# EAGLE design integrated_bldc (EAGLE 6.6.0)
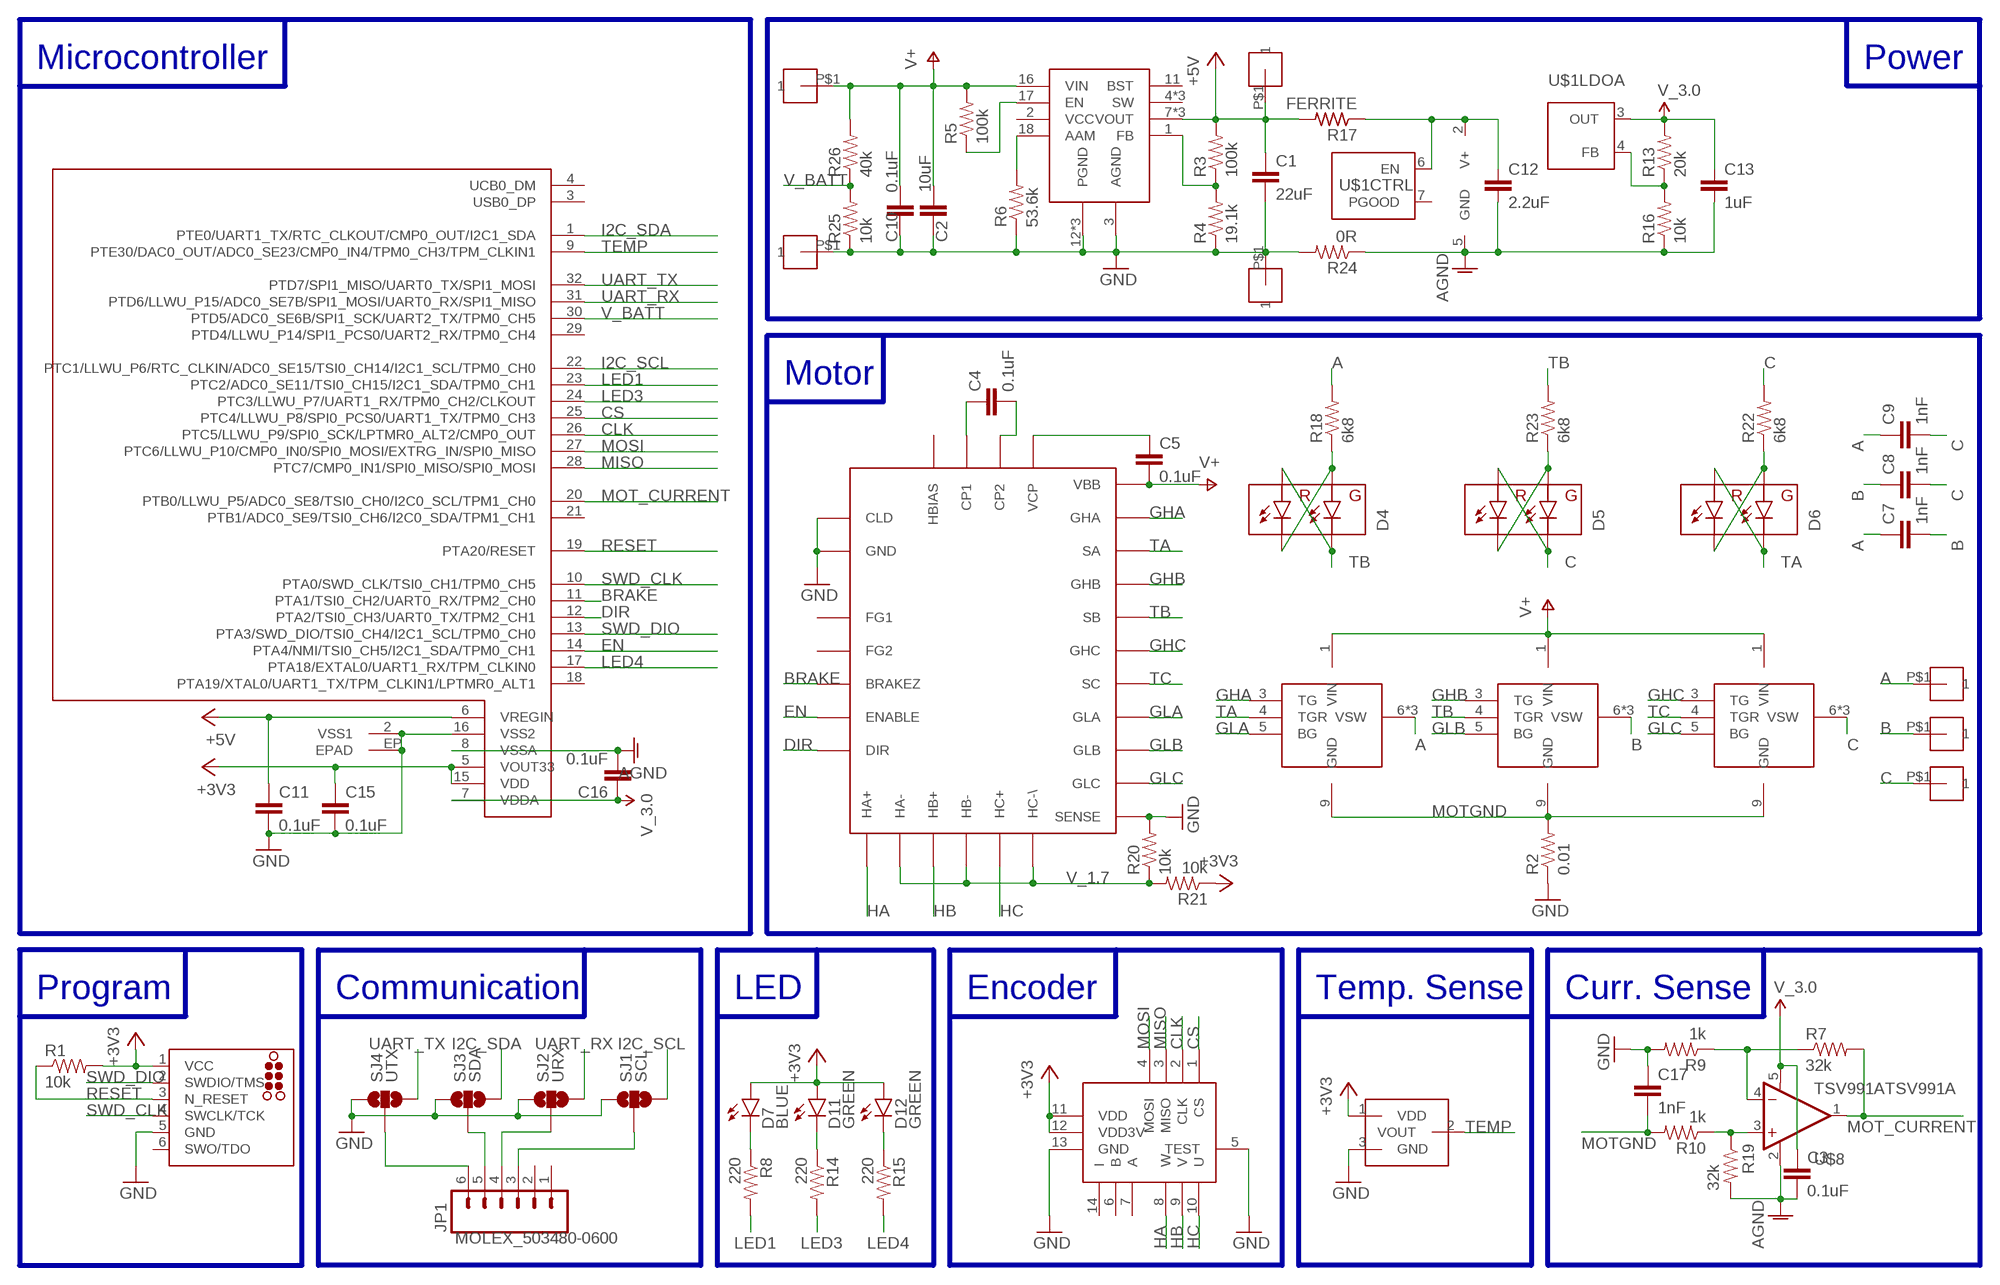
[diagram p0: schematic, sheet 1]

## Parts
AS5047P  AS5047P  [TSSOP14]
C1  22uF  CAP1210  [1210]
C2  10uF  CAP1206  [1206]
C3  0.1uF  CAP0402-CAP  [0402-CAP]
C4  0.1uF  CAP0402-CAP  [0402-CAP]
C5  0.1uF  CAP0402-CAP  [0402-CAP]
C7  1nF  CAP0603-CAP  [0603-CAP]
C8  1nF  CAP0603-CAP  [0603-CAP]
C9  1nF  CAP0603-CAP  [0603-CAP]
C10  0.1uF  CAP0603-CAP  [0603-CAP]
C11  0.1uF  CAP0402-CAP  [0402-CAP]
C12  2.2uF  CAP0402-CAP  [0402-CAP]
C13  1uF  CAP0402-CAP  [0402-CAP]
C15  0.1uF  CAP0402-CAP  [0402-CAP]
C16  0.1uF  CAP0402-CAP  [0402-CAP]
C17  1nF  CAP0402-CAP  [0402-CAP]
D4  LED-RGLTST-C195KGJRKT  [LTST-C195KGJRKT]
D5  LED-RGLTST-C195KGJRKT  [LTST-C195KGJRKT]
D6  LED-RGLTST-C195KGJRKT  [LTST-C195KGJRKT]
D7  BLUE  LED-BLUE0603  [LED-0603]
D11  GREEN  LED-GREEN0603  [LED-0603]
D12  GREEN  LED-GREEN0603  [LED-0603]
J2  PRG  TC2030-MCP-NL  [TC2030-MCP-NL]
JP1  MOLEX_503480-0600  [MOLEX_503480-0600]
R1  10k  RESISTOR0402-RES  [0402-RES]
R2  0.01  RESISTOR1206  [1206]
R3  100k  RESISTOR0402-RES  [0402-RES]
R4  19.1k  RESISTOR0402-RES  [0402-RES]
R5  100k  RESISTOR0402-RES  [0402-RES]
R6  53.6k  RESISTOR0402-RES  [0402-RES]
R7  32k  RESISTOR0402-RES  [0402-RES]
R8  220  RESISTOR0402-RES  [0402-RES]
R9  1k  RESISTOR0402-RES  [0402-RES]
R10  1k  RESISTOR0402-RES  [0402-RES]
R13  20k  RESISTOR0402-RES  [0402-RES]
R14  220  RESISTOR0402-RES  [0402-RES]
R15  220  RESISTOR0402-RES  [0402-RES]
R16  10k  RESISTOR0402-RES  [0402-RES]
R17  FERRITE  R-US_R0603  [R0603]
R18  6k8  RESISTOR0402-RES  [0402-RES]
R19  32k  RESISTOR0402-RES  [0402-RES]
R20  10k  RESISTOR0402-RES  [0402-RES]
R21  10k  RESISTOR0402-RES  [0402-RES]
R22  6k8  RESISTOR0402-RES  [0402-RES]
R23  6k8  RESISTOR0402-RES  [0402-RES]
R24  0R  RESISTOR0402-RES  [0402-RES]
R25  10k  RESISTOR0402-RES  [0402-RES]
R26  40k  RESISTOR0402-RES  [0402-RES]
SJ1  SCL  SOLDERJUMPER_2WAY  [SJ_TINY]
SJ2  URX  SOLDERJUMPER_2WAY  [SJ_TINY]
SJ3  SDA  SOLDERJUMPER_2WAY  [SJ_TINY]
SJ4  UTX  SOLDERJUMPER_2WAY  [SJ_TINY]
U$1  SC560C  [MLPQ-UT8]
U$2  A4931SMT  [28-CONTACT-QFN-ET]
U$3  MKL25Z128VFM4  [QFN-32]
U$4  MOSFET-HALFBRIDGECSD87333Q3D  [SON8]
U$5  MOSFET-HALFBRIDGECSD87333Q3D  [SON8]
U$6  MOSFET-HALFBRIDGECSD87333Q3D  [SON8]
U$7  MPM3610MPM3610GQV  [QFN20]
U$8  TSV991ATSV991A  [SOT23-5]
U$9  SOT_TEMP_SENSE  [SOT23-3]
U$10  A  PADMOT  [SMD_MOT_PAD]
U$11  B  PADMOT  [SMD_MOT_PAD]
U$12  C  PADMOT  [SMD_MOT_PAD]
VIN+  V+  PAD  [SMD_BAT_PAD]
VIN-  GND  PAD  [SMD_BAT_PAD]
VOUT+  A  PADMOT  [SMD_MOT_PAD]
VOUT-  A  PADMOT  [SMD_MOT_PAD]

## Nets
+3V3: AS5047P.11(VDD) AS5047P.12(VDD3V) C15.1 D7.A D11.A D12.A J2.1(VCC) R1.2 R21.1 U$3.5(VOUT33) U$3.15(VDD) U$9.1(VDD)
+5V: C1.1 C11.1 R3.2 R17.2 U$3.6(VREGIN) U$7.7(VOUT) U$7.8(VOUT) U$7.9(VOUT) VOUT+.P$1
A: C7.1 C9.1 R18.2 U$5.6(VSW) U$5.7(VSW) U$5.8(VSW) U$10.P$1
AGND: C3.2 C12.2 C13.2 C16.2 R16.1 R19.2 R24.1 U$1.5(GND) U$3.8(VSSA) U$8.2(V-)
B: C7.2 C8.1 U$4.6(VSW) U$4.7(VSW) U$4.8(VSW) U$11.P$1
BEN: R5.1 U$7.17(EN)
BRAKE: U$2.28(BRAKEZ) U$3.11(PTA1/TSI0_CH2/UART0_RX/TPM2_CH0)
C: C8.2 C9.2 D5.P$2(RA) D5.P$3(GC) R22.2 U$6.6(VSW) U$6.7(VSW) U$6.8(VSW) U$12.P$1
CLK: AS5047P.2(CLK) U$3.26(PTC5/LLWU_P9/SPI0_SCK/LPTMR0_ALT2/CMP0_OUT)
CS: AS5047P.1(CS) U$3.25(PTC4/LLWU_P8/SPI0_PCS0/UART1_TX/TPM0_CH3)
DIR: U$2.26(DIR) U$3.12(PTA2/TSI0_CH3/UART0_TX/TPM2_CH1)
EN: U$2.27(ENABLE) U$3.14(PTA4/NMI/TSI0_CH5/I2C1_SDA/TPM0_CH1)
FB: R3.1 R4.2 U$7.1(FB)
GHA: U$2.21(GHA) U$5.3(TG)
GHB: U$2.19(GHB) U$4.3(TG)
GHC: U$2.17(GHC) U$6.3(TG)
GLA: U$2.16(GLA) U$5.5(BG)
GLB: U$2.15(GLB) U$4.5(BG)
GLC: U$2.14(GLC) U$6.5(BG)
GND: AS5047P.5(TEST) AS5047P.13(GND) C1.2 C2.2 C10.2 C11.2 C15.2 C17.1 J2.5(GND) R2.1 R4.1 R6.1 R9.2 R20.2 R24.2 R25.1 SJ1.1 SJ2.1 SJ3.1 SJ4.1 U$2.7(GND) U$2.13(SENSE) U$2.25(CLD) U$3.2(VSS1) U$3.16(VSS2) U$3.EP(EPAD) U$7.3(AGND) U$7.12(PGND) U$7.13(PGND) U$7.14(PGND) U$9.3(GND) VIN-.P$1 VOUT-.P$1
HA: AS5047P.8(W) U$2.1(HA+)
HB: AS5047P.9(V) U$2.3(HB+)
HC: AS5047P.10(U) U$2.5(HC+)
I2C_SCL: SJ1.3 U$3.22(PTC1/LLWU_P6/RTC_CLKIN/ADC0_SE15/TSI0_CH14/I2C1_SCL/TPM0_CH0)
I2C_SDA: SJ3.3 U$3.1(PTE0/UART1_TX/RTC_CLKOUT/CMP0_OUT/I2C1_SDA)
LED1: R8.2 U$3.23(PTC2/ADC0_SE11/TSI0_CH15/I2C1_SDA/TPM0_CH1)
LED3: R14.2 U$3.24(PTC3/LLWU_P7/UART1_RX/TPM0_CH2/CLKOUT)
LED4: R15.2 U$3.17(PTA18/EXTAL0/UART1_RX/TPM_CLKIN0)
MISO: AS5047P.3(MISO) U$3.28(PTC7/CMP0_IN1/SPI0_MISO/SPI0_MOSI)
MOSI: AS5047P.4(MOSI) U$3.27(PTC6/LLWU_P10/CMP0_IN0/SPI0_MOSI/EXTRG_IN/SPI0_MISO)
MOT_CURRENT: R7.2 U$3.20(PTB0/LLWU_P5/ADC0_SE8/TSI0_CH0/I2C0_SCL/TPM1_CH0) U$8.1(OUT)
MOTGND: C17.2 R2.2 R10.2 U$4.9(GND) U$5.9(GND) U$6.9(GND)
N$1: R7.1 R9.1 U$8.4(-IN)
N$2: R10.1 R19.1 U$8.3(+IN)
N$3: D4.P$1(GA) D4.P$4(RC) R18.1
N$4: D7.C R8.1
N$5: R6.2 U$7.18(AAM)
N$10: D11.C R14.1
N$12: D12.C R15.1
N$13: R13.1 R16.2 U$1.4(LDOA:FB)
N$14: D5.P$1(GA) D5.P$4(RC) R23.1
N$15: C12.1 R17.1 U$1.2(V+) U$1.6(CTRL:EN)
N$16: D6.P$1(GA) D6.P$4(RC) R22.1
N$19: C5.1 U$2.12(VCP)
N$20: C4.1 U$2.9(CP1)
N$21: C4.2 U$2.10(CP2)
N$36: JP1.6 SJ4.2
N$37: JP1.5 SJ3.2
N$38: JP1.4 SJ2.2
N$39: JP1.3 SJ1.2
RESET: J2.3(N_RESET) R1.1 U$3.19(PTA20/RESET)
SWD_CLK: J2.4(SWCLK/TCK) U$3.10(PTA0/SWD_CLK/TSI0_CH1/TPM0_CH5)
SWD_DIO: J2.2(SWDIO/TMS) U$3.13(PTA3/SWD_DIO/TSI0_CH4/I2C1_SCL/TPM0_CH0)
TA: D6.P$2(RA) D6.P$3(GC) U$2.22(SA) U$5.4(TGR)
TB: D4.P$2(RA) D4.P$3(GC) R23.2 U$2.20(SB) U$4.4(TGR)
TC: U$2.18(SC) U$6.4(TGR)
TEMP: U$3.9(PTE30/DAC0_OUT/ADC0_SE23/CMP0_IN4/TPM0_CH3/TPM_CLKIN1) U$9.2(VOUT)
UART_RX: SJ2.3 U$3.31(PTD6/LLWU_P15/ADC0_SE7B/SPI1_MOSI/UART0_RX/SPI1_MISO)
UART_TX: SJ4.3 U$3.32(PTD7/SPI1_MISO/UART0_TX/SPI1_MOSI)
V+: C2.1 C5.2 C10.1 R5.2 R26.2 U$2.11(VBB) U$4.1(VIN) U$5.1(VIN) U$6.1(VIN) U$7.16(VIN) VIN+.P$1
V_1.7: R20.1 R21.2 U$2.2(HA-) U$2.4(HB-) U$2.6(HC-\)
V_3.0: C3.1 C13.1 C16.1 R13.2 U$1.3(LDOA:OUT) U$3.7(VDDA) U$8.5(V+)
V_BATT: R25.2 R26.1 U$3.30(PTD5/ADC0_SE6B/SPI1_SCK/UART2_TX/TPM0_CH5)
Unconnected: AS5047P.6(B) AS5047P.7(A) AS5047P.14(I) J2.6(SWO/TDO) JP1.1 JP1.2 U$1.1(LDOB:OUT) U$1.7(CTRL:PGOOD) U$1.8(LDOB:FB) U$2.8(HBIAS) U$2.23(FG1) U$2.24(FG2) U$3.3(USB0_DP) U$3.4(UCB0_DM) U$3.18(PTA19/XTAL0/UART1_TX/TPM_CLKIN1/LPTMR0_ALT1) U$3.21(PTB1/ADC0_SE9/TSI0_CH6/I2C0_SDA/TPM1_CH1) U$3.29(PTD4/LLWU_P14/SPI1_PCS0/UART2_RX/TPM0_CH4) U$7.2(VCC) U$7.4(SW) U$7.5(SW) U$7.6(SW) U$7.11(BST)

## Buses
B$1
B$2
B$3
B$4
B$5
B$6
B$7
B$8
B$9

## Notes on the sheet
- Microcontroller | Power
- Motor
- Program | Communication | LED | Encoder | Temp. Sense | Curr. Sense

## Library data of the parts
AS5047P = dhaldane:AS5047P
C1-C5 C7-C11 C15-C17 = SparkFun-Passives:CAP: Capacitor Standard 0603 ceramic capacitor, and 0.1" leaded capacitor.
C12 = biomimetic:CAP: Capacitor Standard 0603 ceramic capacitor, and 0.1" leaded capacitor.; VOLTAGE: 10V
C13 = biomimetic:CAP: Capacitor Standard 0603 ceramic capacitor, and 0.1" leaded capacitor.; VOLTAGE: 6.3V
D4-D6 = SparkFun-LED:LED-RG; PROD_ID: DIO-12140
D7 = SparkFun-LED:LED-BLUE: Blue LEDs for production use Various blue LEDs stocked by SparkFun production 0603 - DIO-08575 Rebel - DIO-09553 1206 - DIO-09911; PROD_ID: DIO-08575
D11 D12 = SparkFun-LED:LED-GREEN: Various green LEDs Green LEDs used in SFE Production 0603- DIO-00821 LARGE- DIO-00862 LILYPAD- DIO-09910; PROD_ID: DIO-00821
J2 = tag-connect:TC2030: TAG-CONNECT ICSP Connector Manufacturer: Tag-Connect <http://www.tag-connect.com> Cable for easy In-Circuit Serial Programming. Designed for Microchip ICD2, suitable for many others. Two variants - one "with legs" (for hands-free fit on PCB) and another "without legs" for quick programming. PAD Description 1 MCLR/Vpp 2 Vdd 3 GND 4 PGD (ISPDAT) 5 PGC (ISPCLK) 6 nc (used for LVP) ©2009 ROFA.cz - modified and updated by Robert Darlington ‹rdarlington@gmail.com›
JP1 = biomimetic:MOLEX_503480-0600
R1-R10 R14 R15 R18-R24 = SparkFun-Passives:RESISTOR: Resistor Basic schematic elements and footprints for 0603, 1206, and PTH resistors.
R13 R16 R25 R26 = biomimetic:RESISTOR: Resistor Basic schematic elements and footprints for 0603, 1206, and PTH resistors.
R17 = rcl:R-US_: RESISTOR, American symbol
SJ1-SJ4 = modular_robotics:SOLDERJUMPER_2WAY: Solder Jumper 2 way solder jumper
U$1 = modular_robotics:SC560C
U$2 = ee192:A4931
U$3 = dhaldane:MKL25Z128VFM4
U$4-U$6 = dhaldane:MOSFET-HALFBRIDGE
U$7 = dhaldane:MPM3610
U$8 = dhaldane:TSV991A
U$9 = dhaldane:SOT_TEMP_SENSE
U$10-U$12 VIN+ VIN- VOUT+ VOUT- = dhaldane:PAD

## Board
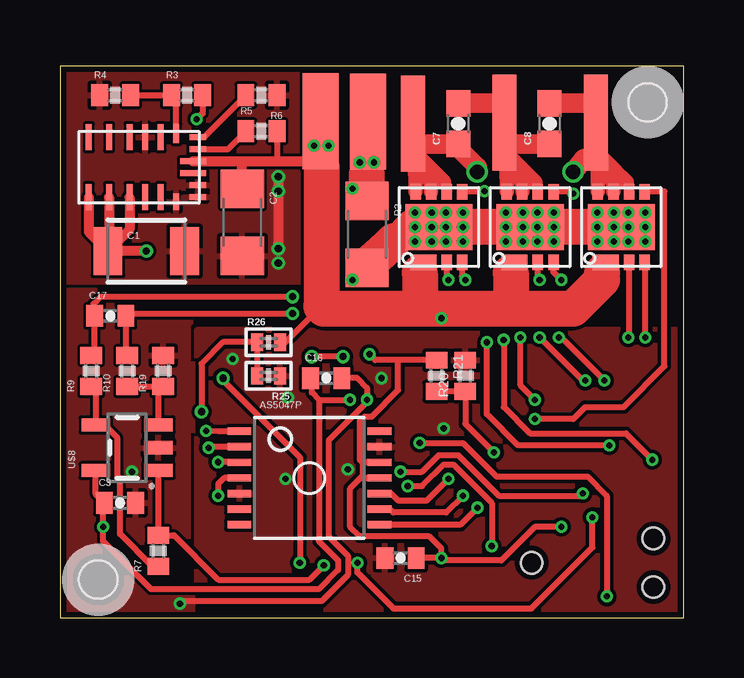
[diagram p1: board, top side]
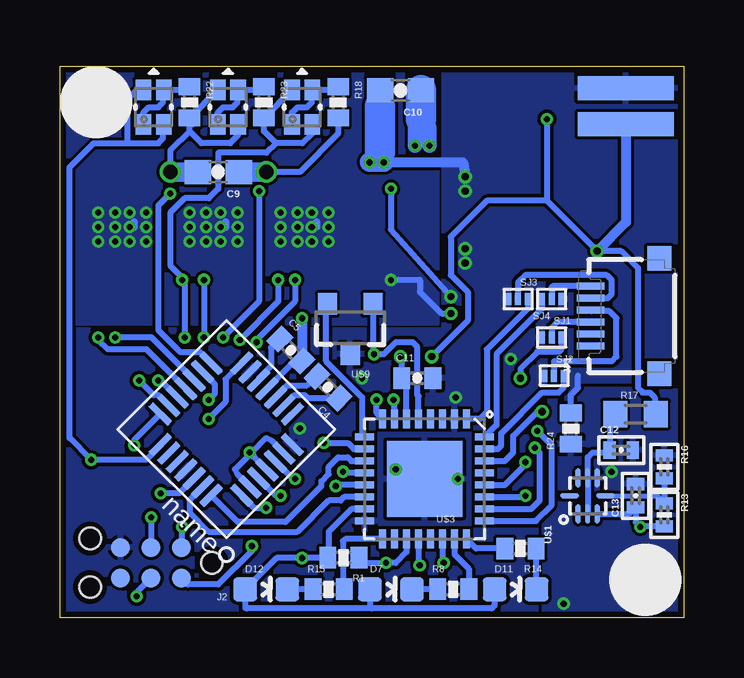
[diagram p2: board, bottom side, seen from below]

Size 26 x 23 mm. Coordinates in mm from the lower left corner, seen from the top.
Outline: 0,0 26,0 26,23 0,23 0,0
Copper layers (1*16): Top 0.035mm / dielectric 1.5mm / Bottom 0.035mm
Design rules "33each *": minimum track width 5mil, minimum drill 10mil, track to track 5mil, track to pad 5mil, pad to pad 5mil, via to via 5mil, smd to smd 5mil, copper to edge 10mil, drill to drill 10mil, minimum pad ring 5mil, minimum via ring 5mil, stop-mask expansion 4mil, vias tented up to drill 25mil, thermal gap 6mil
Holes 1.6 mm at 1.6,1.6 24.5,21.5

### Footprints (pad centres in the part's own frame; a part is rotated, then mirrored left to right if it is on the bottom)
TSSOP14 = smd 0.991 x 0.305: 1 -2.918,4.49; 2 -2.918,3.84; 3 -2.918,3.19; 4 -2.918,2.54; 5 -2.918,1.89; 6 -2.918,1.24; 7 -2.918,0.59; 8 2.918,0.59; 9 2.918,1.24; 10 2.918,1.89; 11 2.918,2.54; 12 2.918,3.19; 13 2.918,3.84; 14 2.918,4.49
1210 = smd 1.2 x 2: 1 -1.6,0; 2 1.6,0
1206 = smd 1.6 x 1.8: 1 -1.4,0; 2 1.4,0
0402-CAP = smd 0.7 x 0.9: 1 -0.65,0; 2 0.65,0
0603-CAP = smd 1.1 x 1: 1 -0.85,0; 2 0.85,0
0402-CAP' = smd 0.508 x 0.711: 1 -0.483,0; 2 0.483,0
LTST-C195KGJRKT = smd 0.65 x 0.85: P$1 0.425,0.725; P$2 -0.425,0.725; P$3 0.425,-0.725; P$4 -0.425,-0.725
LED-0603 = smd 1 x 1: A 0,-0.877; C 0,0.877
TC2030-MCP-NL = smd 0.787 x 0.787: 1 1.27,-0.635; 2 1.27,0.635; 3 2.54,-0.635; 4 2.54,0.635; 5 3.81,-0.635; 6 3.81,0.635 | hole 0.889: 0,0; 5.08,-1.016; 5.08,1.016
MOLEX_503480-0600 = smd 0.3 x 1.15: 1 -1.25,1.725; 2 -0.75,1.725; 3 -0.25,1.725; 4 0.25,1.725; 5 0.75,1.725; 6 1.25,1.725 | smd 1.035 x 1: L -2.408,-1.15; R 2.408,-1.15
0402-RES = smd 0.7 x 0.9: 1 -0.65,0; 2 0.65,0
0402-RES' = smd 0.508 x 0.711: 1 -0.483,0; 2 0.483,0
R0603 = smd 1 x 1.1: 1 -0.85,0; 2 0.85,0
SJ_TINY = smd 0.5 x 0.25: 1 0,0.4; 2 0,0; 3 0,-0.4
MLPQ-UT8 = smd 0.8 x 0.2: 1 -0.75,0.4; 2 -0.75,0; 3 -0.75,-0.4; 5 0.75,-0.4; 6 0.75,0; 7 0.75,0.4 | smd 0.2 x 0.8: 4 0,-0.75; 8 0,0.75
28-CONTACT-QFN-ET = smd 1.15 x 0.3: 1 -2.4,1.5; 2 -2.4,1; 3 -2.4,0.5; 4 -2.4,0; 5 -2.4,-0.5; 6 -2.4,-1; 7 -2.4,-1.5; 15 2.4,-1.5; 16 2.4,-1; 17 2.4,-0.5; 18 2.4,0; 19 2.4,0.5; 20 2.4,1; 21 2.4,1.5 | smd 0.3 x 1.15: 8 -1.5,-2.4; 9 -1,-2.4; 10 -0.5,-2.4; 11 0,-2.4; 12 0.5,-2.4; 13 1,-2.4; 14 1.5,-2.4; 22 1.5,2.4; 23 1,2.4; 24 0.5,2.4; 25 0,2.4; 26 -0.5,2.4; 27 -1,2.4; 28 -1.5,2.4
QFN-32 = smd 0.285 x 0.8: 1 -1.75,-2.5; 2 -1.25,-2.5; 3 -0.75,-2.5; 4 -0.25,-2.5; 5 0.25,-2.5; 6 0.75,-2.5; 7 1.25,-2.5; 8 1.75,-2.5; 17 1.75,2.5; 18 1.25,2.5; 19 0.75,2.5; 20 0.25,2.5; 21 -0.25,2.5; 22 -0.75,2.5; 23 -1.25,2.5; 24 -1.75,2.5 | smd 0.8 x 0.285: 9 2.5,-1.75; 10 2.5,-1.25; 11 2.5,-0.75; 12 2.5,-0.25; 13 2.5,0.25; 14 2.5,0.75; 15 2.5,1.25; 16 2.5,1.75; 25 -2.5,1.75; 26 -2.5,1.25; 27 -2.5,0.75; 28 -2.5,0.25; 29 -2.5,-0.25; 30 -2.5,-0.75; 31 -2.5,-1.25; 32 -2.5,-1.75 | smd 3.15 x 3.15: EP 0,0
SON8 = smd 0.65 x 1.09: 1 1.475,-0.65 | smd 0.65 x 0.44: 3 1.475,0.325; 4 1.475,0.975; 5 -1.475,0.975; 6 -1.475,0.325; 7 -1.475,-0.325; 8 -1.475,-0.975 | smd 1.9 x 2.8: 9 0,0
QFN20 = smd 0.8 x 0.25: 1 -1.4,1.55 | smd 1.1 x 0.25: 2 -1.25,0.9; 3 -1.25,0.25; 4 -1.25,-0.4; 5 -1.25,-1.25; 6 -1.25,-2.1; 7 1.25,-2.1; 8 1.25,-1.25; 9 1.25,-0.4; 10 1.25,0.25; 11 1.25,0.9 | smd 0.7 x 0.25: 12 1.45,1.55 | smd 0.25 x 0.7: 13 1.25,2.45; 14 0.75,2.45; 17 -0.75,2.45; 18 -1.25,2.45 | smd 0.25 x 1.1: 15 0.25,2.25; 16 -0.25,2.25
SOT23-5 = smd 0.55 x 1.2: 1 -0.95,-1.3; 2 0,-1.3; 3 0.95,-1.3; 4 0.95,1.3; 5 -0.95,1.3
SOT23-3 = smd 0.8 x 0.9: 1 -0.95,-1; 2 0.95,-1; 3 0,1.1
SMD_MOT_PAD = smd 4 x 1: P$1 0.2,0
SMD_BAT_PAD = smd 4 x 1.5: P$1 0.1,0.05

### Placement (x,y rotation side)
AS5047P  10.4,3.3 0 top
C1  3.6,15.3 0 top
C2  7.6,16.5 270 top
C3  2.5,4.8 0 top
C4  14.83,9.63 135 bottom
C5  16.37,11.17 315 bottom
C7  16.61,20.61 90 top
C8  20.42,20.61 90 top
C9  19.4,18.6 180 bottom
C10  11.8,22 180 bottom
C11  11.1,10 0 bottom
C12  2.2uF  [0402-CAP']  2.6,7 0 bottom
C13  1uF  [0402-CAP']  2,5.1 90 bottom
C15  14.2,2.5 180 top
C16  11.1,10 0 top
C17  2.1,12.6 0 top
D4  15.9,21.3 180 bottom
D5  19,21.3 180 bottom
D6  22.1,21.3 180 bottom
D7  12.2,1.2 270 bottom
D11  7,1.2 270 bottom
D12  17.4,1.2 270 bottom
J2  19.66,2.3 180 bottom
JP1  2.16,12.59 90 bottom
R1  14.18,2.52 180 bottom
R2  12.8,16 270 top
R3  5.3,21.8 0 top
R4  2.3,21.8 0 top
R5  8.4,20.3 0 top
R6  8.4,21.8 180 top
R7  4.1,2.8 90 top
R8  9.6,1.2 0 bottom
R9  1.3,10.3 90 top
R10  2.8,10.3 90 top
R13  20k  [0402-RES']  0.8,4.3 270 bottom
R14  6.8,2.9 180 bottom
R15  14.8,1.2 0 bottom
R16  10k  [0402-RES']  0.8,6.3 270 bottom
R17  2,8.5 0 bottom
R18  14.4,21.5 270 bottom
R19  4.3,10.3 90 top
R20  16.9,10.1 90 top
R21  15.7,10.1 270 top
R22  20.6,21.5 270 bottom
R23  17.5,21.5 270 bottom
R24  4.7,7.9 90 bottom
R25  10k  [0402-RES']  8.7,10.1 180 top
R26  40k  [0402-RES']  8.7,11.5 0 top
SJ1  5.5,11.7 90 bottom
SJ2  5.4,10.1 90 bottom
SJ3  6.9,13.3 90 bottom
SJ4  5.5,13.3 270 bottom
U$1  4,5.1 90 bottom
U$2  19.06,7.87 135 bottom
U$3  10.8,5.8 180 bottom
U$4  19.6,16.3 270 top
U$5  15.8,16.3 270 top
U$6  23.4,16.3 270 top
U$7  3.3,18.8 270 top
U$8  2.8,7.1 90 top
U$9  13.9,12.1 180 bottom
U$10  14.72,20.4 90 top
U$11  18.54,20.46 90 top
U$12  22.35,20.46 90 top
VIN+  10.82,20.81 270 top
VIN-  12.8,20.8 270 top
VOUT+  2.6,20.6 0 bottom
VOUT-  2.6,22.1 0 bottom

### Tracks (layer width: path | path; a pad name or v marks a point on that pad's centre or on a via)
+3V3  (via drill 0.25)
  Top 0.254: v20.9,3.8 19.8,3.8 18.4,2.4 16,2.4 v15.9,2.5 | v15.9,2.5 C15.1 | v15.9,2.5 15.9,2.9 15.4,3.4 12.5,3.4 12.1,3.8 12.1,5.4 12.54,5.84 | 12.54,5.84 AS5047P.11 | R21.1 14.1,10.75 | 14.1,10.75 13.15,10.75 v12.9,11 | AS5047P.12 12.61,6.49 | 14.1,10.75 14.1,9.5 13,8.4 12.7,8.4 12.5,8.2 12.5,6.6 12.61,6.49 | 12.61,6.49 12.61,5.91 12.54,5.84
  Bottom 0.254: D11.A 7.88,0.52 8,0.4 13,0.4 | 13,0.4 18.2,0.4 18.22,0.42 18.28,0.42 D12.A 16.98,2.5 v15.9,2.5 C15.1 arc-90 R1.2 14.8,2.55 14.8,3.6 13.85,4.55 U$3.15 | D7.A 13.08,0.48 13,0.4 | J2.1 20.9,2.97 v20.9,3.8 | U$3.5 11.05,9.25 11.1,9.3 11.1,11.3 11.3,11.5 12,11.5 12.5,11 v12.9,11 12.95,11.05 U$9.1
+5V  (via drill 0.25, 0.3)
  Top 0.254: R3.2 5.95,21.05 v5.7,20.8 | v11.8,10.9 v10.5,10.9
  Top 0.406: U$7.9 2.9,16.2 C1.1 | U$7.7 1.2,16.1 C1.1 | U$7.8 2.05,15.35 C1.1 | v3.6,15.3 C1.1
  Bottom 0.254: v5.7,20.8 5.7,17.4 | 5.7,17.4 v3.6,15.3 2.6,15.3 1.9,14.6 1.9,9.6 1.7,9.4 1.4,9.4 1.2,9.2 1.2,8.55 R17.2 | U$3.6 11.55,9.8 C11.1 11.75,10.85 v11.8,10.9 | 5.7,17.4 8.2,17.4 9.7,15.9 9.7,14.3 9,13.6 9,12.4 v10.5,10.9
  Bottom 0.406: VOUT+.P$1 2.4,16.5 v3.6,15.3
A  (via drill 0.6)
  Top 0.254: 14.72,20.46 U$10.P$1
  Top 0.406: 16.01,18.19 arc-90 16.11,18.09 U$5.6
  Top 0.61: 16.01,18.19 15.5,18.7 15.4,18.5 15.46,18.44 U$5.7 | U$5.8 14.81,19.09 14.75,19.15
  Top 0.813: U$10.P$1 14.76,20.7 | 14.72,19.5 14.99,19.76 C7.1 16.61,19.59 17.4,18.8 v17.4,18.6
  Top 1.016: 14.72,20.46 14.72,19.5 14.72,19.18 14.75,19.15 15.4,18.5
  Bottom 0.254: R18.2 14.4,20.2 16,18.6 v17.4,18.6
  Bottom 0.813: C9.1 v17.4,18.6
AGND  (via drill 0.25)
  Top 0.254: C16.2 12.4,10 12.8,9.6 v12.8,9.1 12.8,9 11.2,7.4 11.2,3.4 12,2.6 12,1.8 10.9,0.7 5.1,0.7
  Bottom 0.254: U$3.8 12.8,8.55 v12.8,9.1
  other vias: 3,6.1 5,0.6
  pour Top (rank 2): 0,0 0,13.7 5.5,13.7 5.5,0
  pour Bottom: 0,0 0,9.5 5.8,9.5 5.8,0
B
  Top 0.406: 19.82,18.18 19.92,18.08 U$4.6
  Top 0.61: 19.82,18.18 19.4,18.6 19.3,18.6 19.2,18.5 19.27,18.43 U$4.7 | U$4.8 18.62,18.82 18.75,18.95
  Top 0.813: 18.57,20.76 U$11.P$1 18.6,20.72 18.6,21.3 18.44,21.46 C7.2 | C8.1 18.7,19.76 18.54,19.6
  Top 1.016: 19.2,18.5 18.75,18.95 18.54,19.16 18.54,19.6 U$11.P$1
BEN
  Top 0.254: U$7.17 7,19.55 R5.1
BRAKE
  Bottom 0.254: U$2.28 18.58,4 16.6,4 15.1,5.5 15.1,5.7 14.8,6 14.8,6.3 14.4,6.7 14,6.7 13.85,6.55 U$3.11
C  (via drill 0.6)
  Top 0.406: U$6.6 23.73,18.07 23.5,18.3
  Top 0.61: 23.63,18.17 23.5,18.3 23.2,18.6 23.1,18.6 23,18.5 23.08,18.42 U$6.7 | U$6.8 22.43,18.93 22.5,19
  Top 0.813: 22.38,20.76 U$12.P$1 22.4,20.71 22.4,21.4 22.34,21.46 C8.2 | v21.4,18.6 21.85,19.15 22.35,19.15
  Top 1.016: U$12.P$1 22.35,19.15 22.5,19 23,18.5
  Bottom 0.254: D5.P$3 R22.2 20.6,20.3 | D5.P$2 18.57,20.12 18.9,19.8 20.1,19.8 20.6,20.3 | 20.6,20.3 21.4,19.5 v21.4,18.6
  Bottom 0.406: 20.49,20.67 R22.2
  Bottom 0.813: C9.2 v21.4,18.6
CLK  (via drill 0.25)
  Top 0.254: AS5047P.2 6.24,7.14 v6.2,7.1
  Bottom 0.254: U$3.26 6.35,4.55 6,4.9 6,6.9 v6.2,7.1
CS  (via drill 0.25)
  Top 0.254: AS5047P.1 6.61,7.79 v6.1,7.8
  Bottom 0.254: U$3.25 6.15,4.05 5.5,4.7 5.5,7.2 v6.1,7.8
DIR  (via drill 0.25)
  Top 0.254: v14.2,6.1 15.1,6.1 15.8,6.8 16.6,6.8 18.3,5.1 21.7,5.1 v21.8,5.2
  Bottom 0.254: U$2.26 21.03,5.2 v21.8,5.2 | U$3.12 14.15,6.05 v14.2,6.1
EN
  Bottom 0.254: U$2.27 20.6,4.92 20.6,4.4 19.8,3.6 16.1,3.6 14.8,4.9 14.3,4.9 14.15,5.05 U$3.14
FB
  Top 0.254: R4.2 R3.1 4.85,21.6 U$7.1
GHA  (via drill 0.25 pad 0.25)
  Top 0.254: U$5.3 16.11,14.19 v16.2,14.1 | v17.8,11.5 17.8,8.5 19.1,7.2 v22.9,7.2
  Bottom 0.254: v16.2,14.1 16.2,13.2 17.8,11.6 v17.8,11.5 | U$2.21 22.9,7.43 v22.9,7.2
GHB  (via drill 0.25, 0.25 pad 0.25)
  Top 0.254: U$4.3 19.9,14.8 19.9,14.2 v20,14.1 | v20,11.7 21.8,9.9 v21.9,9.9
  Bottom 0.254: v20,14.1 v20,11.7 | U$2.19 21.8,9.9 v21.9,9.9
GHC  (via drill 0.25 pad 0.25)
  Top 0.254: U$6.3 23.73,11.72 v23.7,11.7
  Bottom 0.254: U$2.17 22.18,11.7 v23.7,11.7
GLA  (via drill 0.25 pad 0.25)
  Top 0.254: U$5.5 16.79,17.8 v17.7,17.8 | v19.8,9.1 19.2,9.7 v19.2,11.7
  Bottom 0.254: U$2.16 20.05,10.25 19.55,9.75 19.55,9.35 v19.8,9.1 | v17.7,17.8 17.7,13.2 v19.2,11.7
GLB  (via drill 0.25 pad 0.25)
  Top 0.254: U$4.5 20.6,17.8 21.3,17.8 arc-90 v21.4,17.7
  Bottom 0.254: v21.4,17.7 21.9,17.2 21.9,12 21,11.1 20.17,11.1 U$2.15
GLC  (via drill 0.25 pad 0.25)
  Top 0.254: U$6.5 24.41,17.8 25.2,17.8 25.2,10.5 23.5,8.8 21.9,8.8 21.4,8.3 v19.8,8.3
  Bottom 0.254: U$2.14 19.1,9.96 19.1,9 v19.8,8.3
GND  (via drill 0.25, 0.3)
  Top 0.254: v12.2,17.9 12.7,17.4 R2.1 | R9.2 1.45,11.1 C17.1 1.4,12.65 1.4,13.1 1.7,13.4 v9.7,13.4
  Top 0.406: v9.1,18.4 v9.1,15.4
  Top 0.61: VIN-.P$1 12.85,19.25 v13.1,19 v12.5,19
  Top 0.813: v12.5,19 12.5,18.8 12.8,18.5
  Top 1.5: R2.1 12.8,18.5
  Bottom 0.254: 16.26,7.24 U$2.7 | v12.2,17.9 12.2,16.2 v9.7,13.4 | U$3.EP 11.6,5.8 v12,6.2 | R24.2 4.7,9.3 4.4,9.6 4.4,10.1
  Bottom 0.305: 12.65,19.45 12.5,19.45 v12.5,19
  Bottom 0.406: v12.5,19 9.2,19 v9.1,18.4
  Bottom 0.61: C10.2 12.65,21.35
  Bottom 0.813: v13.1,19 v12.5,19
  Bottom 1.27: 12.65,19.45 12.65,21.35
  other vias: 16,7.9 13.4,10 7.2,10.8 9.1,17.8 9.1,14.8 9.4,5.8 9.5,9.2
  pour Top (isolate 0.15): 5.7,0 26,0 26,12 5.7,12
  pour Bottom (isolate 0.14, rank 2): 0,0 26,0 26,12 10,12 10,23 0,23
  pour Top: 0,23 10,23 10,14 0,14
HA  (via drill 0.25)
  Top 0.254: v17.4,4.6 16.69,3.89 AS5047P.8
  Bottom 0.254: U$2.1 17.91,4.6 v17.4,4.6
HB  (via drill 0.25)
  Top 0.254: v16.8,5.1 16.1,4.4 13.9,4.4 13.76,4.54 AS5047P.9
  Bottom 0.254: U$2.3 17,5.1 v16.8,5.1
HC  (via drill 0.25)
  Top 0.254: v16.2,5.8 15.3,4.9 14.1,4.9 13.81,5.19 AS5047P.10
  Bottom 0.254: U$2.5 16.28,5.8 v16.2,5.8
I2C_SCL  (via drill 0.25, 0.3)
  Top 0.254: v10,2.3 10,6.7 6.8,9.9 v6.8,10
  Bottom 0.254: U$3.22 10.05,2.35 v10,2.3 | SJ1.3 5.1,11.2 5.2,11.1 6.1,11.1 6.8,10.4 v6.8,10
I2C_SDA
  Bottom 0.254: U$3.1 8.5,8.3 8.2,8.6 8.2,11.2 6.5,12.9 SJ3.3
LED1
  Bottom 0.254: U$3.23 9.55,2.65 8.95,2.05 R8.2
LED3
  Bottom 0.254: R14.2 8.65,2.9 U$3.24
LED4
  Bottom 0.254: U$3.17 14.1,3.3 14.2,3.2 14.2,1.25 R15.2
MISO  (via drill 0.25)
  Top 0.254: AS5047P.3 v6.6,6.5
  Bottom 0.254: U$3.28 7.45,5.55 6.6,6.4 v6.6,6.5
MOSI  (via drill 0.25)
  Top 0.254: AS5047P.4 6.84,5.84 6.6,5.6 v6.6,5.1
  Bottom 0.254: U$3.27 6.65,5.05 v6.6,5.1
MOT_CURRENT  (via drill 0.25)
  Top 0.254: U$8.1 | U$8.1 R7.2 4.75,3.45 6.6,1.6 10.4,1.6 v11,2.2
  Bottom 0.254: U$3.20 11.05,2.25 v11,2.2
MOTGND  (via drill 0.25, 0.3)
  Top 0.254: R10.2 2.75,11 C17.2 2.85,12.7 v9.7,12.7
  Top 0.305: 15.76,16.31 15.5,16.31 v15.5,16.3 15.5,16.5 15.58,16.5
  Top 1.016: 13.9,15.7 13.9,15.8 14.6,16.5 15.58,16.5
  Top 1.422: 15.76,16.31 U$5.9
  Top 1.5: R2.2 12.8,14.7 13.9,15.7 | U$6.9 v23.1,16.3 U$4.9 v19.3,16.3 U$5.9
  Bottom 0.254: v12.2,14.1 11,14.1 11,13.6 10.1,12.7 v9.7,12.7
  Bottom 0.305: 15.3,16.3 15.3,16.5 | 19.1,16.3 19.1,16.5 | 22.9,16.3 22.9,16.5
  other vias: 16.1,16.9 16.1,16.3 16.1,15.7 16.8,16.9 16.8,16.3 16.8,15.7 14.8,16.9 14.8,16.3 14.8,15.7 15.5,16.9 15.5,15.7 19.9,16.9 19.9,16.3 19.9,15.7 20.6,16.9 20.6,16.3 20.6,15.7 18.6,16.9 18.6,16.3 18.6,15.7 19.3,16.9 19.3,15.7 23.7,16.9 23.7,16.3 23.7,15.7 24.4,16.9 24.4,16.3 24.4,15.7 22.4,16.9 22.4,16.3 22.4,15.7 23.1,16.9 23.1,15.7
  pour Bottom (rank 2): 10.3,12.3 26,12.3 26,23 10.3,23
N$1
  Top 0.254: R7.1 3.85,2.15 2.5,3.5 2.5,5.8 2.4,5.9 2.4,7.5 2,7.9 1.65,7.9 U$8.4 1.5,9.45 R9.1
N$2
  Top 0.254: U$8.3 4.1,9.45 R19.1 R10.1
N$3
  Bottom 0.254: D4.P$1 16.32,21.07 16.1,21.3 15.7,21.3 15.5,21.5 15.5,22 D4.P$4 14.53,22.02 R18.1
N$4
  Bottom 0.254: R8.1 D7.C
N$5
  Top 0.254: U$7.18 6,20.05 R6.2
N$10
  Bottom 0.254: R14.1 6.15,1.23 D11.C
N$12
  Bottom 0.254: R15.1 D12.C
N$13
  Bottom 0.2: U$1.4 1.12,5.1
  Bottom 0.254: 1.12,5.1 R13.1 R16.2
N$14
  Bottom 0.254: D5.P$1 19.43,21.07 19.2,21.3 18.8,21.3 18.6,21.5 18.6,22 D5.P$4 17.62,22.02 R23.1
N$15
  Bottom 0.254: R17.1 2.85,8.2 3.08,7.97 C12.1 3.18,6.9 3.8,6.9 4,6.7 U$1.6 U$1.2
N$16
  Bottom 0.254: D6.P$1 22.52,21.07 22.3,21.3 21.9,21.3 21.7,21.5 21.7,22 D6.P$4 20.73,22.02 R22.1
N$19
  Bottom 0.254: C5.1 17.2,11.27 17.2,10.5 17.72,9.98 U$2.12
N$20
  Bottom 0.254: U$2.9 16.22,9.3 15.8,9.3 15.67,9.17 C4.1
N$21
  Bottom 0.254: U$2.10 16.53,9.7 15.7,9.7 15.31,10.09 C4.2
N$36
  Bottom 0.254: JP1.6 5.46,13.84 5.5,13.8 SJ4.2
N$37
  Bottom 0.254: JP1.5 3.16,13.34 3,13.5 3,14.1 3.2,14.3 6.6,14.3 6.9,14 SJ3.2
N$38
  Bottom 0.254: JP1.4 3.84,12.8 3.1,12.8 2.8,12.5 2.8,10.9 3,10.7 5.4,10.7 SJ2.2
N$39
  Bottom 0.254: JP1.3 5.26,12.34 5.5,12.1 SJ1.2
RESET  (via drill 0.25)
  Top 0.254: v22.2,4.2 J2.3 19.66,0.4 13.9,0.4 12.4,1.9 v12.4,2.3
  Bottom 0.254: U$3.19 11.55,2.75 12,2.3 v12.4,2.3 13.32,2.3 R1.1 | v22.2,4.2 J2.3
SWD_CLK  (via drill 0.25)
  Top 0.254: v15,7.3 16.8,7.3 18.2,5.9 22,5.9 22.8,5.1 v22.8,0.9
  Bottom 0.254: 22.2,1.4 J2.4 22.8,1.07 v22.8,0.9 | v15,7.3 14,7.3 13.75,7.05 U$3.10
SWD_DIO  (via drill 0.25)
  Top 0.254: v14.5,5.5 15.1,5.5 16,6.4 16.4,6.4 18,4.8 v18,3
  Bottom 0.254: U$3.13 14.45,5.55 v14.5,5.5 | v18,3 18,2.8 19.4,1.4 20.66,1.4 J2.2
TA  (via drill 0.25 pad 0.25)
  Top 0.254: U$5.4 16.76,14.24 v16.9,14.1 | v18.5,11.6 18.5,8.8 19.6,7.7 23.6,7.7 v24.7,6.6
  Bottom 0.254: U$2.22 21.76,7.24 22.4,6.6 v24.7,6.6 25.6,7.5 25.6,18.8 24.6,19.8 23.2,19.8 | D6.P$3 22.77,22.02 23.2,21.6 23.2,19.8 | 23.2,19.8 21.9,19.8 21.7,20 21.7,20.55 D6.P$2 | v16.9,14.1 16.9,13.2 v18.5,11.6
TB  (via drill 0.25)
  Top 0.254: 20.5,14.8 20.52,14.82 U$4.4 20.57,14.43 v20.9,14.1 | v20.8,11.7 20.9,11.7 v22.7,9.9
  Bottom 0.254: U$2.20 21.9,9.3 22.1,9.3 v22.7,9.9 | D4.P$3 R23.2 17.5,20.3 17,19.8 | D4.P$2 15.47,20.23 15.9,19.8 17,19.8 | 17,19.8 17.4,19.4 19.4,19.4 19.4,17.9 19.8,17.5 20.8,17.5 21.4,16.9 21.4,14.7 20.9,14.2 v20.9,14.1 20.8,14 v20.8,11.7
TC  (via drill 0.25 pad 0.25)
  Top 0.254: 24.4,14.82 U$6.4 24.38,11.72 v24.4,11.7
  Bottom 0.254: U$2.18 22.39,11.2 24,11.2 24.4,11.6 v24.4,11.7
TEMP
  Bottom 0.254: U$9.2 14.9,12.79 14.9,10.7 13.4,9.2 13.4,7.65 U$3.9
UART_RX
  Bottom 0.254: U$3.31 7.75,7.05 7.6,7.2 7.6,7.7 5.9,9.4 5.2,9.4 5,9.6 SJ2.3
UART_TX
  Bottom 0.254: SJ4.3 5.9,12.9 7.8,11 7.8,8.05 U$3.32
V+  (via drill 0.25, 0.25 pad 0.25)
  Top 0.254: 9,19.05 8.95,19.1 9.05,19.2 R5.2 | v15.9,12.5 15.5,12.5 15.1,12.9 | 10.9,13 9.4,11.5 R26.2
  Top 0.406: U$7.16 7.7,19.05 | 7.7,19.05 9,19.05 10.75,19.05 10.9,18.9 | C2.1 7.6,18.95 7.7,19.05 | v10.6,19.7 10.4,20.24 VIN+.P$1
  Top 0.61: 22.6,14.4 22.75,14.55 U$6.1 | 18.8,14.4 18.94,14.64 U$4.1 | 15,14.39 15.13,14.52 U$5.1 | 10.75,19.05 10.75,19.55 v10.6,19.7
  Top 1.5: 10.9,18.9 10.9,13 11,12.9 15,12.9 | 15,12.9 15.1,12.9 18.8,12.9 | 18.8,12.9 21.4,12.9 22.6,14.1 22.6,14.4 | 18.8,14.4 18.8,12.9 | 15,14.39 15,12.9
  Bottom 0.254: 15.91,10.79 C5.2 16.22,10.71 U$2.11
  Bottom 0.406: v15.9,12.5 15.91,10.79
  Bottom 0.61: v10.6,19.7 10.6,20.44 VIN+.P$1 | v11.2,19.7 11.2,20.38 VIN+.P$1 | 10.95,20.79 VIN+.P$1
  Bottom 1.27: C10.1 10.95,20.79
V_1.7  (via drill 0.25)
  Top 0.254: v18.1,6.9 16.9,8.1 R20.1 R21.2
  Bottom 0.254: 17.9,6.7 18,6.9 17.4,7.5 17.18,7.4 U$2.6 | 17.9,6.7 17.38,6.17 U$2.4 | 18.1,6.8 18.7,6.2 18.6,6 U$2.2 | 18.1,6.8 17.9,6.7 | 18.1,6.8 v18.1,6.9
V_3.0  (via drill 0.25)
  Top 0.254: 10.5,9.85 C16.1 10.5,9.95 10.5,9.4 10.8,9.1 | U$8.5 1.5,5.15 C3.1 1.8,4.75 v1.8,3.8 1.8,3.2 3.8,1.2 10.8,1.2 11.6,2 11.6,2.4 10.8,3.2 10.8,9.1 | 10.8,9.1 v12.1,9.1
  Bottom 0.254: 12.15,9.05 v12.1,9.1 12.05,9.05 U$3.7 | R13.2 1.78,3.82 v1.8,3.8 2,4 C13.1 2.27,4.35 U$1.3
V_BATT  (via drill 0.3)
  Top 0.254: v5.9,8.6 5.9,10.6 6.8,11.5 R26.1 R25.2
  Bottom 0.254: U$3.30 7.45,6.55 7.1,6.9 7.1,7.6 6.1,8.6 v5.9,8.6